# Altium project VCO.PrjPcb
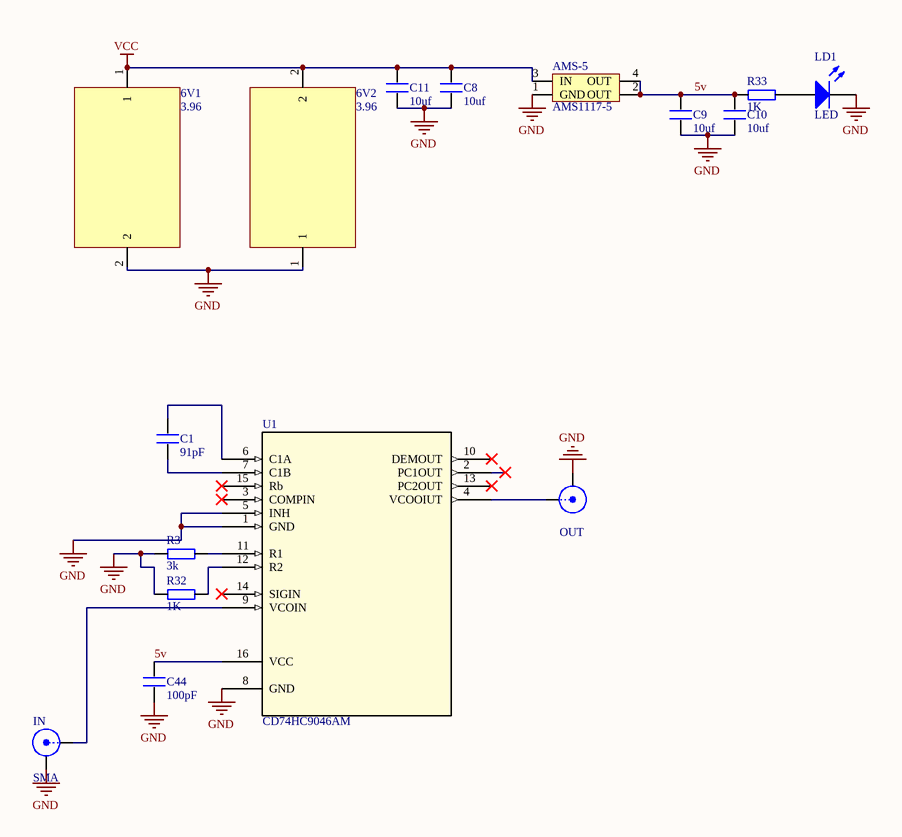
[diagram p0: VCO.SchDoc]
1 sheet, 16 parts. Net scope: global (net labels, ports and power ports of the same name join across sheets).
Board file: VCO.PcbDoc

## Sheet VCO.SchDoc
size A4

### Parts
6V1  3.96  [3.96]
6V2  3.96  [3.96]
AMS-5  AMS1117-5  [AMS1117]
C1  91pF  [0603C]
C8  10uf  [0603C]
C9  10uf  [0603C]
C10  10uf  [0603C]
C11  10uf  [0603C]
C44  100pF  [0603C]
IN  SMA  [SMA]
LD1  LED  [SMDLED]
OUT  SMA  [SMA]  (value not drawn)
R3  3k  [0603R]
R32  1K  [0603R]
R33  1K  [0603R]
U1  CD74HC9046AM  [D16]

### Nets
GND: 6V1.2 6V2.1 AMS-5.1(GND) C8.1 C9.1 C10.1 C11.1 C44.1 IN.2(Y) LD1.2(K) OUT.2(Y) R3.1 R32.1 U1.1(GND) U1.5(INH) U1.8(GND)
VCC: 6V1.1 6V2.2 AMS-5.3(IN) C8.2 C11.2
5v: AMS-5.2(OUT) AMS-5.4(OUT) C9.2 C10.2 C44.2 R33.1 U1.16(VCC)
NetC1_1: C1.1 U1.7(C1B)
NetC1_2: C1.2 U1.6(C1A)
NetIN_1: IN.1(X) U1.9(VCOIN)
NetLD1_1: LD1.1(A) R33.2
NetOUT_1: OUT.1(X) U1.4(VCOOIUT)
NetR3_2: R3.2 U1.11(R1)
NetR32_2: R32.2 U1.12(R2)

Not connected (* = marked no-connect by the designer): U1 2(PC1OUT)* 3(COMPIN)* 10(DEMOUT)* 13(PC2OUT)* 14(SIGIN)* 15(Rb)*

### Library data of the parts
AMS-5 = AMS1117
C1 C8-C11 C44 = C: Capacitor
IN OUT = SMA: SMA Connector
LD1 = LED: Typical RED, GREEN, YELLOW, AMBER GaAs LED; Published: 8-Jun-2000; LatestRevisionDate: 17-Jul-2002; LatestRevisionNote: Re-released for DXP Platform.; PackageDocument: Feb-2002; PackageReference: 3.2X1.6X1.1; Publisher: Altium Limited
R3 R32 R33 = Resistor
U1 = CD74HC9046AM: High Speed CMOS Logic Phase-Locked Loop with VCO and Lock Detector; Manufacturer: Texas Instruments; GENERIC_PART_NUMBER: CD74HC7046A; INDUSTRY_STD_PKG_TYPE: SOIC; FAMILY_NAME: PHASE-LOCKED-LOOP/OSCILLATOR; PIN_COUNT: 16; PACKAGE_DESIGNATOR: D; Datasheet_URL: http://www.ti.com/lit/gpn/CD74HC7046A; Copyright: Copyright (C) 2018 Accelerated Designs. All rights reserved; RefDes: RefDes; Type: DEV